# Altium schematic sheet Otto 1 Harnesses.SchDoc
size A
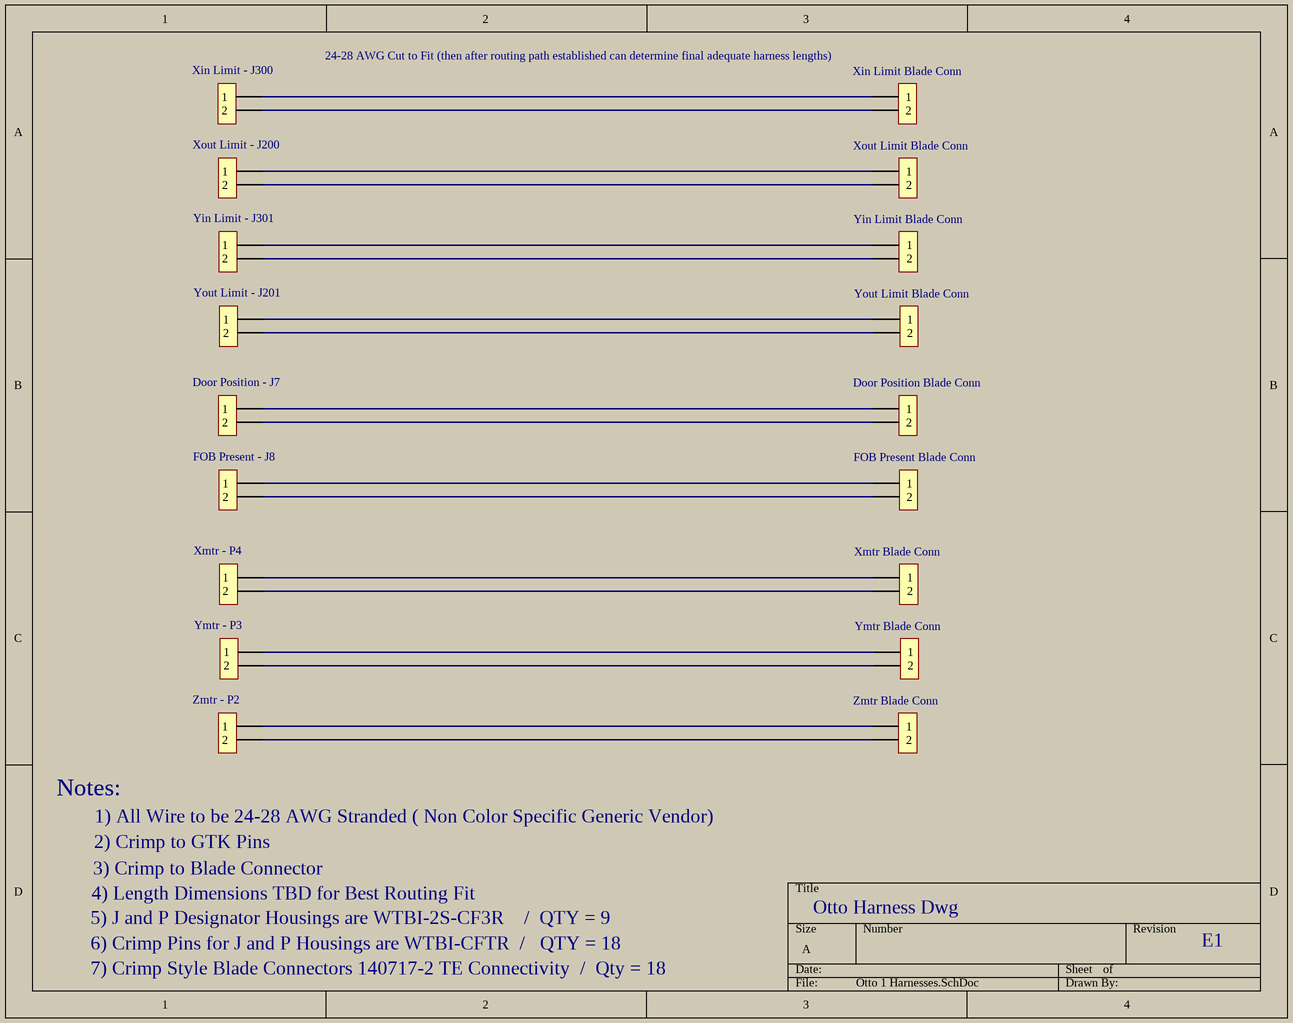
[diagram p0: Otto 1 Harnesses.SchDoc]

## Parts
Door_Position_-_J7  1mm 2 pin Housing  (value not drawn)
Door_Position_Blade_Conn  Crimp Blade Conn  [GTK-2]  (value not drawn)
FOB_Present_-_J8  1mm 2 pin Housing  (value not drawn)
FOB_Present_Blade_Conn  Crimp Blade Conn  [GTK-2]  (value not drawn)
Xin_Limit_-_J300  1mm 2 pin Housing  (value not drawn)
Xin_Limit_Blade_Conn  Crimp Blade Conn  [GTK-2]  (value not drawn)
Xmtr_-_P4  1mm 2 pin Housing  (value not drawn)
Xmtr_Blade_Conn  Crimp Blade Conn  [GTK-2]  (value not drawn)
Xout_Limit_-_J200  1mm 2 pin Housing  (value not drawn)
Xout_Limit_Blade_Conn  Crimp Blade Conn  [GTK-2]  (value not drawn)
Yin_Limit_-_J301  1mm 2 pin Housing  (value not drawn)
Yin_Limit_Blade_Conn  Crimp Blade Conn  [GTK-2]  (value not drawn)
Ymtr_-_P3  1mm 2 pin Housing  (value not drawn)
Ymtr_Blade_Conn  Crimp Blade Conn  [GTK-2]  (value not drawn)
Yout_Limit_-_J201  1mm 2 pin Housing  (value not drawn)
Yout_Limit_Blade_Conn  Crimp Blade Conn  [GTK-2]  (value not drawn)
Zmtr_-_P2  1mm 2 pin Housing  (value not drawn)
Zmtr_Blade_Conn  Crimp Blade Conn  [GTK-2]  (value not drawn)

## Nets
NetDoor_Position_-_J7_1: Door_Position_-_J7.1 Door_Position_Blade_Conn.1
NetDoor_Position_-_J7_2: Door_Position_-_J7.2 Door_Position_Blade_Conn.2
NetFOB_Present_-_J8_1: FOB_Present_-_J8.1 FOB_Present_Blade_Conn.1
NetFOB_Present_-_J8_2: FOB_Present_-_J8.2 FOB_Present_Blade_Conn.2
NetXin_Limit_-_J300_1: Xin_Limit_-_J300.1 Xin_Limit_Blade_Conn.1
NetXin_Limit_-_J300_2: Xin_Limit_-_J300.2 Xin_Limit_Blade_Conn.2
NetXmtr_-_P4_1: Xmtr_-_P4.1 Xmtr_Blade_Conn.1
NetXmtr_-_P4_2: Xmtr_-_P4.2 Xmtr_Blade_Conn.2
NetXout_Limit_-_J200_1: Xout_Limit_-_J200.1 Xout_Limit_Blade_Conn.1
NetXout_Limit_-_J200_2: Xout_Limit_-_J200.2 Xout_Limit_Blade_Conn.2
NetYin_Limit_-_J301_1: Yin_Limit_-_J301.1 Yin_Limit_Blade_Conn.1
NetYin_Limit_-_J301_2: Yin_Limit_-_J301.2 Yin_Limit_Blade_Conn.2
NetYmtr_-_P3_1: Ymtr_-_P3.1 Ymtr_Blade_Conn.1
NetYmtr_-_P3_2: Ymtr_-_P3.2 Ymtr_Blade_Conn.2
NetYout_Limit_-_J201_1: Yout_Limit_-_J201.1 Yout_Limit_Blade_Conn.1
NetYout_Limit_-_J201_2: Yout_Limit_-_J201.2 Yout_Limit_Blade_Conn.2
NetZmtr_-_P2_1: Zmtr_-_P2.1 Zmtr_Blade_Conn.1
NetZmtr_-_P2_2: Zmtr_-_P2.2 Zmtr_Blade_Conn.2

## Notes on the sheet
- (near Xin_Limit_Blade_Conn) 24-28 AWG Cut to Fit (then after routing path established can determine final adequate harness lengths)
- Notes:
- 1) All Wire to be 24-28 AWG Stranded ( Non Color Specific Generic Vendor)
- 4) Length Dimensions TBD for Best Routing Fit
- 3) Crimp to Blade Connector
- 2) Crimp to GTK Pins
- 5) J and P Designator Housings are WTBI-2S-CF3R    /  QTY = 9
- 6) Crimp Pins for J and P Housings are WTBI-CFTR  /   QTY = 18
- 7) Crimp Style Blade Connectors 140717-2 TE Connectivity  /  Qty = 18
- Otto Harness Dwg
- E1

## Library data of the parts
Door_Position_-_J7 FOB_Present_-_J8 Xin_Limit_-_J300 Xmtr_-_P4 Xout_Limit_-_J200 Yin_Limit_-_J301 Ymtr_-_P3 Yout_Limit_-_J201 Zmtr_-_P2 = 2 PIN .1mm GTK Header: WTBI-02S-CF3R  2pin 1mm center GTK Housing
Door_Position_Blade_Conn FOB_Present_Blade_Conn Xin_Limit_Blade_Conn Xmtr_Blade_Conn Xout_Limit_Blade_Conn Yin_Limit_Blade_Conn Ymtr_Blade_Conn Yout_Limit_Blade_Conn Zmtr_Blade_Conn = 2 PIN .1mm GTK Header: 140717-2 TE Connectivity